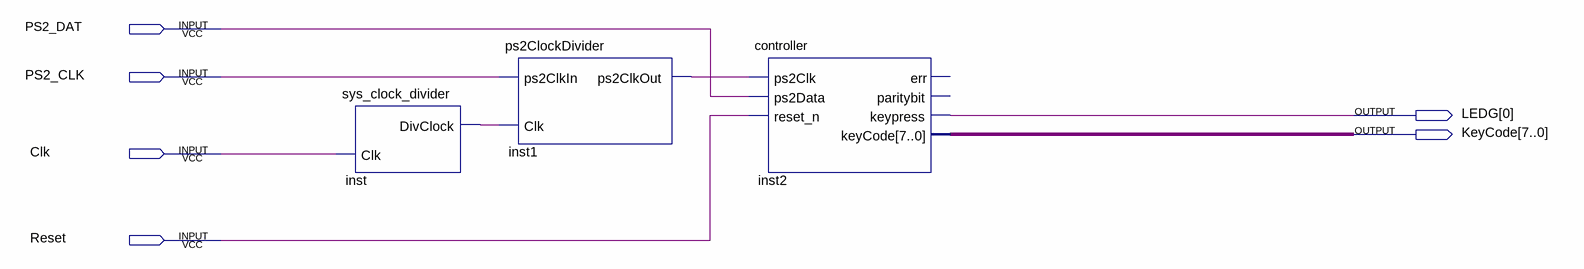
[diagram p0: schematic sheet]
// Quartus schematic ps2KeyboardBlock.bdf as structural Verilog: 3 symbols, 6 pins
module ps2KeyboardBlock (
  input  PS2_DAT,
  input  PS2_CLK,
  input  Clk,
  input  Reset,
  output [0:0] LEDG,
  output [7:0] KeyCode
);

  wire inst1_ps2clkout, inst_divclock;

  sys_clock_divider inst (.Clk(Clk), .DivClock(inst_divclock));
  ps2ClockDivider inst1 (.ps2ClkIn(PS2_CLK), .Clk(inst_divclock), .ps2ClkOut(inst1_ps2clkout));
  controller inst2 (
    .ps2Clk(inst1_ps2clkout), .ps2Data(PS2_DAT), .reset_n(Reset), .keypress(LEDG[0]), .keyCode(KeyCode));  // open: err, paritybit
endmodule
